# EasyEDA Pro project ProProject_STM32F407IGT6_2024-02-27.epro, schematic Schematic2
Create Date: 2023-12-02; Page Name: P1; Project Name: STM32F407IGT6; Schematic Name: Schematic2; Update Date: 2024-01-13; Company: 嘉立创EDA; Page Size: A3; Version: V1.0
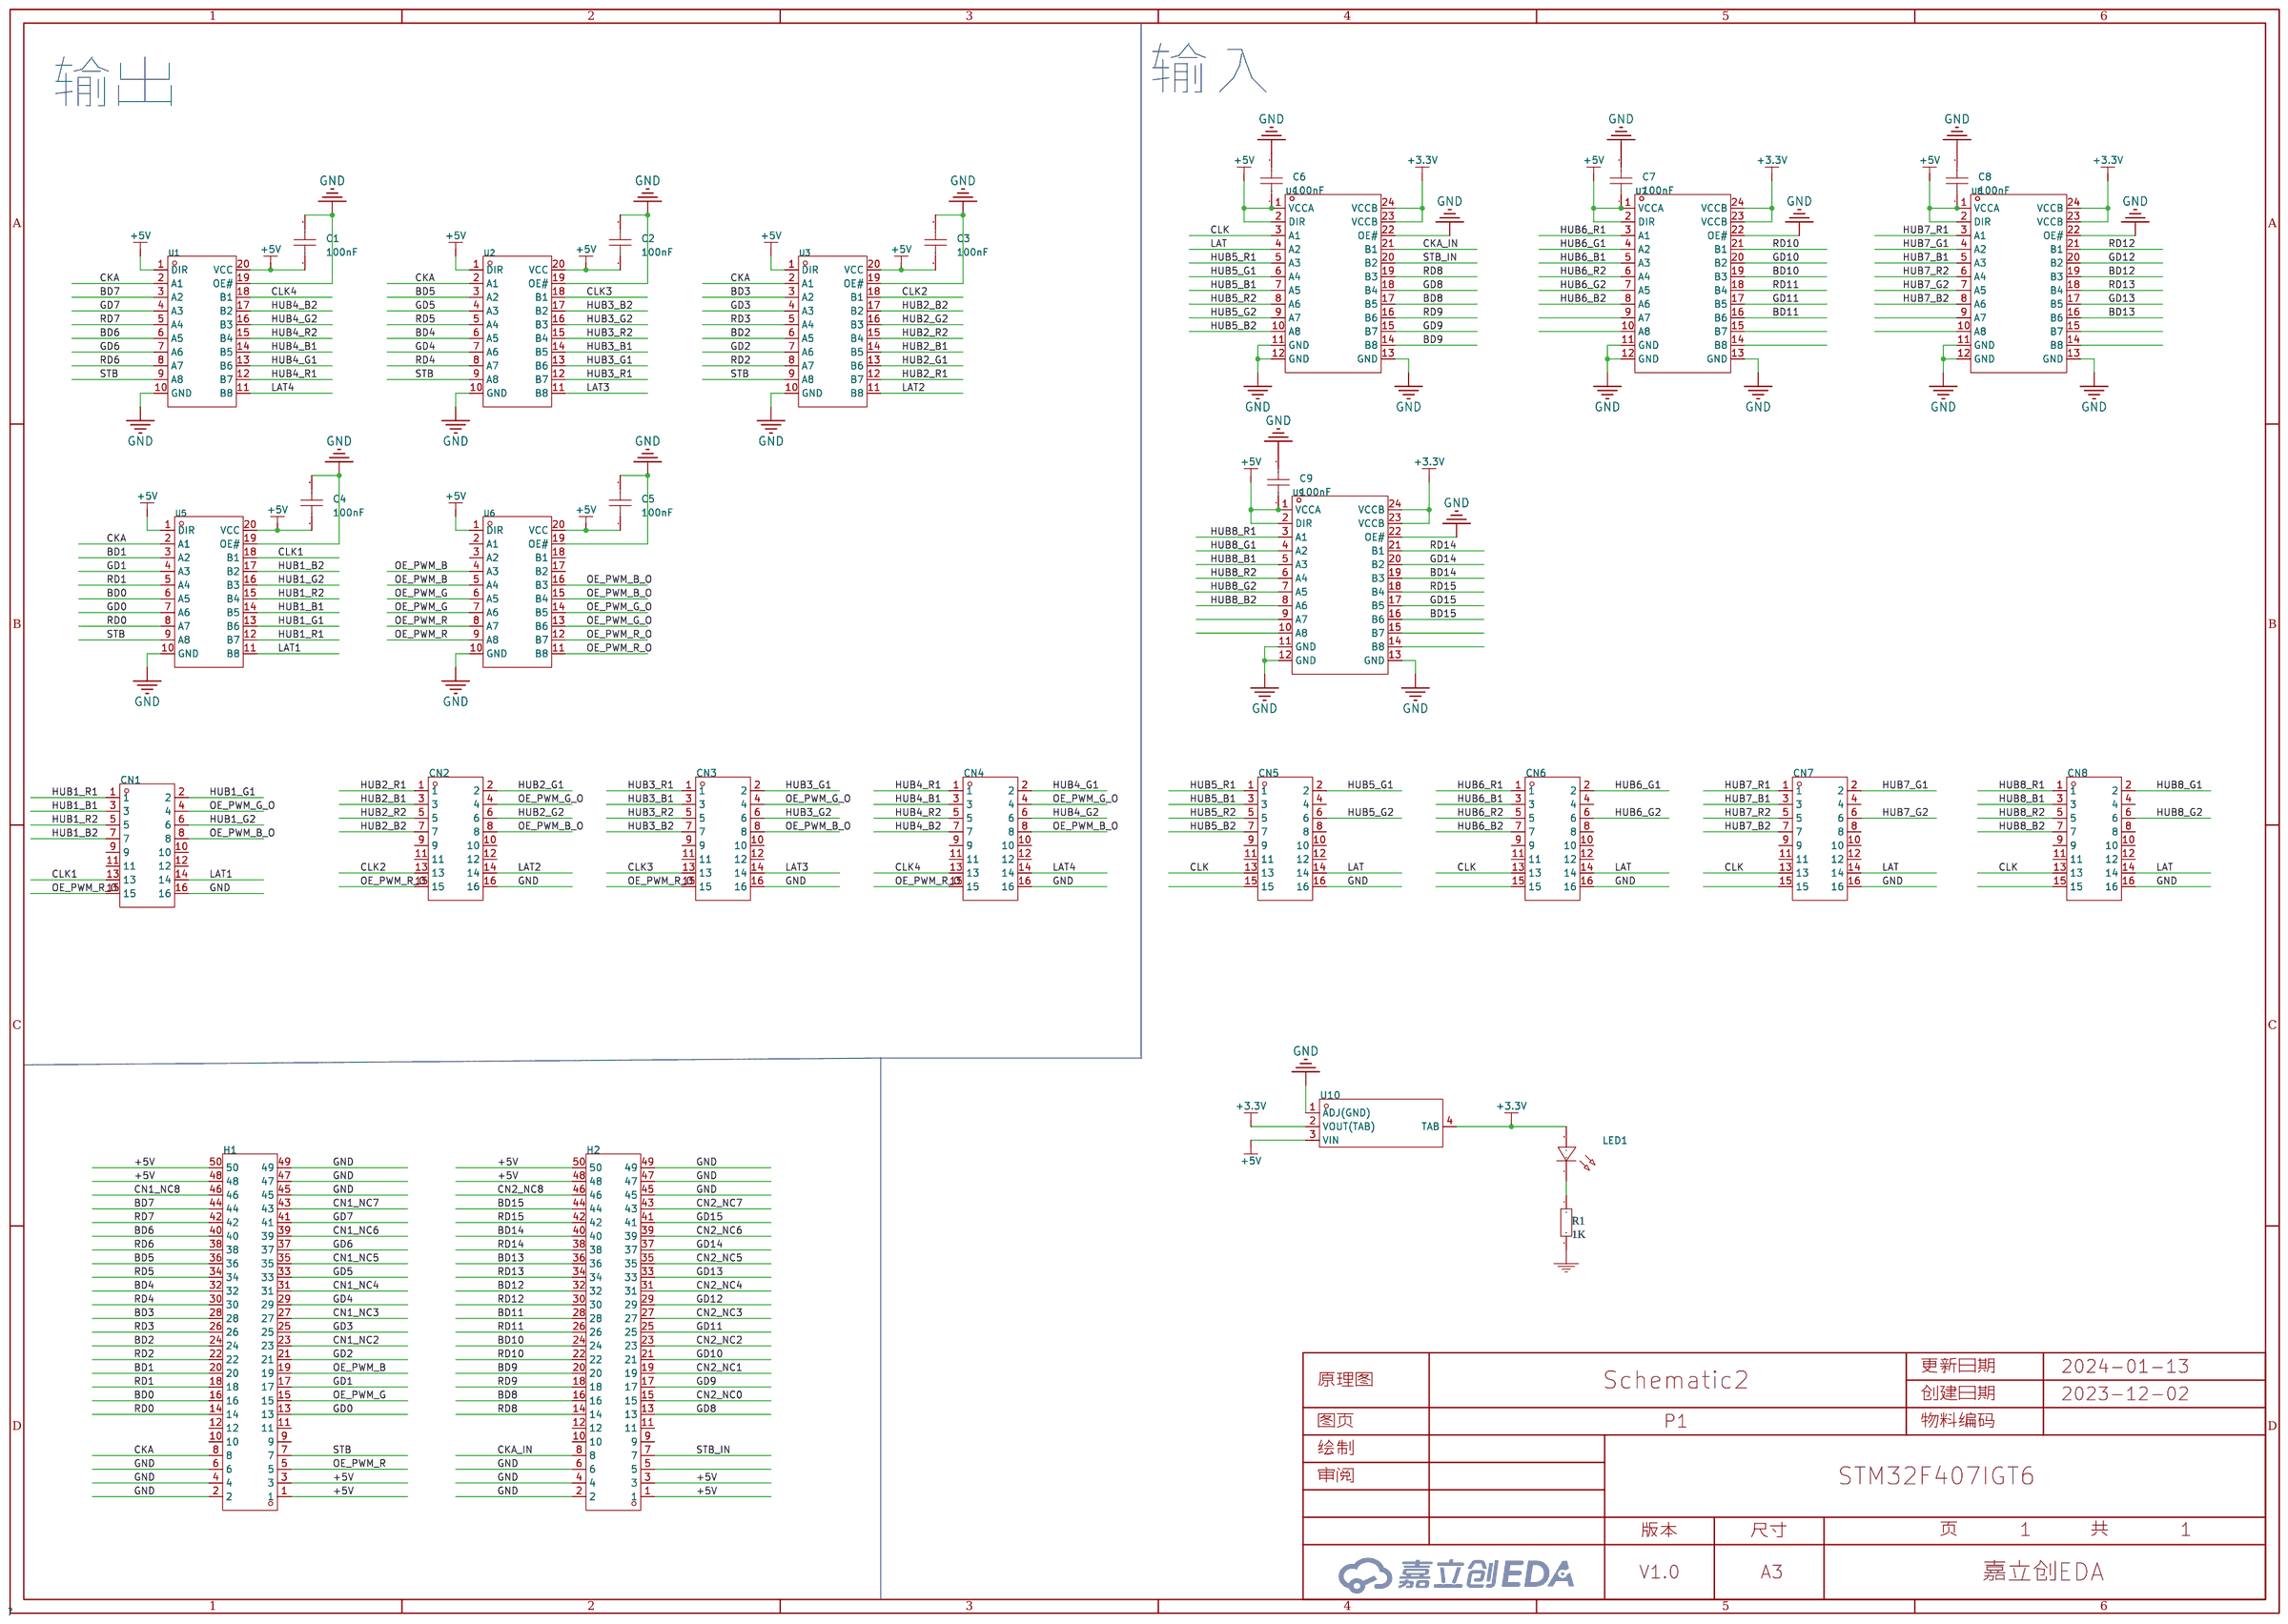
[diagram p2: schematic sheet]

## Parts
C1  100nF  [C0805]
C2  100nF  [C0805]
C3  100nF  [C0805]
C4  100nF  [C0805]
C5  100nF  [C0805]
C6  100nF  [C0805]
C7  100nF  [C0805]
C8  100nF  [C0805]
C9  100nF  [C0805]
CN1  BH254V-16P  [IDC-TH_16P-P2.54-V-R2-C8-S2.54]
CN2  BH254V-16P  [IDC-TH_16P-P2.54-V-R2-C8-S2.54]
CN3  BH254V-16P  [IDC-TH_16P-P2.54-V-R2-C8-S2.54]
CN4  BH254V-16P  [IDC-TH_16P-P2.54-V-R2-C8-S2.54]
CN5  BH254V-16P  [IDC-TH_16P-P2.54-V-R2-C8-S2.54]
CN6  BH254V-16P  [IDC-TH_16P-P2.54-V-R2-C8-S2.54]
CN7  BH254V-16P  [IDC-TH_16P-P2.54-V-R2-C8-S2.54]
CN8  BH254V-16P  [IDC-TH_16P-P2.54-V-R2-C8-S2.54]
H1  FH-00077  [HDR-TH_50P-P2.54-V-F-R2-C25-S2.54-1]
H2  FH-00077  [HDR-TH_50P-P2.54-V-F-R2-C25-S2.54-1]
LED1  -  [LED0805-RD_RED]
R1  1K  [R0805]
U1  SN74HC245PW  [TSSOP-20_L6.5-W4.4-P0.65-LS6.4-BL]
U2  SN74HC245PW  [TSSOP-20_L6.5-W4.4-P0.65-LS6.4-BL]
U3  SN74HC245PW  [TSSOP-20_L6.5-W4.4-P0.65-LS6.4-BL]
U4  SN74LVC4245ADBR  [SSOP-24_L8.4-W5.8-P0.65-LS7.8-BL]
U5  SN74HC245PW  [TSSOP-20_L6.5-W4.4-P0.65-LS6.4-BL]
U6  SN74HC245PW  [TSSOP-20_L6.5-W4.4-P0.65-LS6.4-BL]
U7  SN74LVC4245ADBR  [SSOP-24_L8.4-W5.8-P0.65-LS7.8-BL]
U8  SN74LVC4245ADBR  [SSOP-24_L8.4-W5.8-P0.65-LS7.8-BL]
U9  SN74LVC4245ADBR  [SSOP-24_L8.4-W5.8-P0.65-LS7.8-BL]
U10  AMS1117-3.3  [SOT-223-4_L6.5-W3.5-P2.30-LS7.0-BR]

## Library data of the parts
C1-C9 = CAP_0805: Supplier Footprint: 0805
CN1-CN8 = BH254V-16P: 连接器类型:简牛座;每排PIN数:8;结构:2x8P;排数:2;间距:2.54mm;行距:2.54mm;封装形式:直插;额定电流:3A;额定电压:250V;工作温度范围:-40℃~+105℃;; LCSC Part Name: 每排P数:8 2x8P 排数:2 2.54mm; Supplier Part: C492443; Manufacturer: XFCN(兴飞); Supplier Footprint: 插件,P=2.54mm; JLCPCB Part Class: Extended Part; Datasheet: https://atta.szlcsc.com/upload/public/pdf/source/20200312/C492443_3E905B5DA9DBEF415FB3A1735835F3EF.pdf; Supplier: LCSC; Connector Type: 简牛座; Pin Number in each Row: 8; Structure: 2x8P; Number of Rows: 2; Pitch: 2.54mm; Row Spacing: 2.54mm; Holder Type: 直插; Current Rating (Max): 3A; Voltage Rating (Max): 250V; Operating Temperature Range: -40℃~+105℃
H1 H2 = FH-00077: 排数:双排;总孔位数:50P;间距:2.54mm;插孔结构:2x25P;行距:2.54mm;安装类型:直插;圆孔/方孔:方孔;额定电流:3A;额定电压:-;插孔方向:顶部;塑高:8.5mm;触头材质:黄铜;触头镀层:金;工作温度范围:-40℃~+105℃;焊接温度(最大值):200℃@10S;; LCSC Part Name: 间距:2.54mm 2x25P 直插; Supplier Part: C2829906; Manufacturer: Liansheng(连盛); Supplier Footprint: 插件,P=2.54mm; JLCPCB Part Class: Extended Part; Datasheet: https://atta.szlcsc.com/upload/public/pdf/source/20210507/C2829906_25210A678061599288A41211DEFA1349.pdf; Supplier: LCSC; Number of Rows: 双排; Number of Holes: 50P; Pitch: 2.54mm; Holes Structure: 2x25P; Row Spacing: 2.54mm; Mounting Type: 直插; Circular Hole / Square Hole: 方孔; Current Rating (Max): 3A; Holes Direction: 顶部; Insulation Height: 8.5mm; Contact Material: 黄铜; Contact Plating: 金; Operating Temperature Range: -40℃~+105℃; Welding Temperature (Max): 200℃@10S
LED1 = LED_0805-G: Supplier Footprint: 0805
R1 = 1K: Published: 8-Jun-2000; LatestRevisionDate: 17-Jul-2002; LatestRevisionNote: Re-released for DXP Platform.; PackageReference: AXIAL-0.4; Publisher: Altium Limited
U1-U3 U5 U6 = SN74HC245PW: 具有三态输出的八路总线收发器 20-TSSOP -40 to 85; Supplier Part: C2871191; Manufacturer: TI(德州仪器); Supplier Footprint: TSSOP-20; JLCPCB Part Class: 扩展库; Datasheet: https://www.ti.com/cn/lit/gpn/sn74hc245; Supplier: LCSC
U4 U7-U9 = SN74LVC4245ADBR: SN74LVC4245A 具有三态输出的八路总线收发器和 3.3V 至 5V 移位器; Supplier Part: C7857; Manufacturer: TI(德州仪器); Supplier Footprint: SSOP-24-208mil; JLCPCB Part Class: 扩展库; Datasheet: https://www.ti.com/cn/lit/gpn/sn74lvc4245a; Supplier: LCSC
U10 = AMS1117-3.3_C347222: 输出类型:固定;最大输入电压:18V;输出电压:3.3V;输出电流:1A;电源纹波抑制比(PSRR):60dB@(120Hz);输出极性:正;; LCSC Part Name: 输入18V 输出3.3V 1A; Supplier Part: C347222; Manufacturer: UMW(友台半导体); Supplier Footprint: SOT-223; JLCPCB Part Class: 扩展库; Datasheet: https://atta.szlcsc.com/upload/public/pdf/source/20231109/155D79A26D9DB04352555A58D5969DC8.pdf; Supplier: LCSC; Output Type: 固定; Maximum Input Voltage: 18V; Output Voltage: 3.3V; Output Current: 1A; Power Supply Rejection Ratio (PSRR): 60dB@(120Hz); Dropout Voltage: 1.3V@(1A); Output Polarity: 正; Number of Outputs: 1

## Nets
+3.3V: LED1.2(A) U4.23(VCCB) U4.24(VCCB) U7.23(VCCB) U7.24(VCCB) U8.23(VCCB) U8.24(VCCB) U9.23(VCCB) U9.24(VCCB) U10.2(VOUT(TAB)) U10.4(TAB)
+5V: C1.1 C2.1 C3.1 C4.1 C5.1 C6.1 C7.1 C8.1 C9.1 H1.1 H1.3 H1.48 H1.50 H2.1 H2.3 H2.48 H2.50 U1.1(DIR) U1.20(VCC) U2.1(DIR) U2.20(VCC) U3.1(DIR) U3.20(VCC) U4.1(VCCA) U4.2(DIR) U5.1(DIR) U5.20(VCC) U6.1(DIR) U6.20(VCC) U7.1(VCCA) U7.2(DIR) U8.1(VCCA) U8.2(DIR) U9.1(VCCA) U9.2(DIR) U10.3(VIN)
GND: C1.2 C2.2 C3.2 C4.2 C5.2 C6.2 C7.2 C8.2 C9.2 CN1.16 CN2.16 CN3.16 CN4.16 CN5.16 CN6.16 CN7.16 CN8.16 H1.2 H1.4 H1.6 H1.45 H1.47 H1.49 H2.2 H2.4 H2.6 H2.45 H2.47 H2.49 R1.2 U1.10(GND) U1.19(OE#) U2.10(GND) U2.19(OE#) U3.10(GND) U3.19(OE#) U4.11(GND) U4.12(GND) U4.13(GND) U4.22(OE#) U5.10(GND) U5.19(OE#) U6.10(GND) U6.19(OE#) U7.11(GND) U7.12(GND) U7.13(GND) U7.22(OE#) U8.11(GND) U8.12(GND) U8.13(GND) U8.22(OE#) U9.11(GND) U9.12(GND) U9.13(GND) U9.22(OE#) U10.1(ADJ(GND))
BD0: H1.16 U5.6(A5)
BD1: H1.20 U5.3(A2)
BD2: H1.24 U3.6(A5)
BD3: H1.28 U3.3(A2)
BD4: H1.32 U2.6(A5)
BD5: H1.36 U2.3(A2)
BD6: H1.40 U1.6(A5)
BD7: H1.44 U1.3(A2)
BD8: H2.16 U4.17(B5)
BD9: H2.20 U4.14(B8)
BD10: H2.24 U7.19(B3)
BD11: H2.28 U7.16(B6)
BD12: H2.32 U8.19(B3)
BD13: H2.36 U8.16(B6)
BD14: H2.40 U9.19(B3)
BD15: H2.44 U9.16(B6)
CKA: H1.8 U1.2(A1) U2.2(A1) U3.2(A1) U5.2(A1)
CKA_IN: H2.8 U4.21(B1)
CLK: CN5.13 CN6.13 CN7.13 CN8.13 U4.3(A1)
CLK1: CN1.13 U5.18(B1)
CLK2: CN2.13 U3.18(B1)
CLK3: CN3.13 U2.18(B1)
CLK4: CN4.13 U1.18(B1)
CN1_NC2: H1.23
CN1_NC3: H1.27
CN1_NC4: H1.31
CN1_NC5: H1.35
CN1_NC6: H1.39
CN1_NC7: H1.43
CN1_NC8: H1.46
CN2_NC0: H2.15
CN2_NC1: H2.19
CN2_NC2: H2.23
CN2_NC3: H2.27
CN2_NC4: H2.31
CN2_NC5: H2.35
CN2_NC6: H2.39
CN2_NC7: H2.43
CN2_NC8: H2.46
GD0: H1.13 U5.7(A6)
GD1: H1.17 U5.4(A3)
GD2: H1.21 U3.7(A6)
GD3: H1.25 U3.4(A3)
GD4: H1.29 U2.7(A6)
GD5: H1.33 U2.4(A3)
GD6: H1.37 U1.7(A6)
GD7: H1.41 U1.4(A3)
GD8: H2.13 U4.18(B4)
GD9: H2.17 U4.15(B7)
GD10: H2.21 U7.20(B2)
GD11: H2.25 U7.17(B5)
GD12: H2.29 U8.20(B2)
GD13: H2.33 U8.17(B5)
GD14: H2.37 U9.20(B2)
GD15: H2.41 U9.17(B5)
HUB1_B1: CN1.3 U5.14(B5)
HUB1_B2: CN1.7 U5.17(B2)
HUB1_G1: CN1.2 U5.13(B6)
HUB1_G2: CN1.6 U5.16(B3)
HUB1_R1: CN1.1 U5.12(B7)
HUB1_R2: CN1.5 U5.15(B4)
HUB2_B1: CN2.3 U3.14(B5)
HUB2_B2: CN2.7 U3.17(B2)
HUB2_G1: CN2.2 U3.13(B6)
HUB2_G2: CN2.6 U3.16(B3)
HUB2_R1: CN2.1 U3.12(B7)
HUB2_R2: CN2.5 U3.15(B4)
HUB3_B1: CN3.3 U2.14(B5)
HUB3_B2: CN3.7 U2.17(B2)
HUB3_G1: CN3.2 U2.13(B6)
HUB3_G2: CN3.6 U2.16(B3)
HUB3_R1: CN3.1 U2.12(B7)
HUB3_R2: CN3.5 U2.15(B4)
HUB4_B1: CN4.3 U1.14(B5)
HUB4_B2: CN4.7 U1.17(B2)
HUB4_G1: CN4.2 U1.13(B6)
HUB4_G2: CN4.6 U1.16(B3)
HUB4_R1: CN4.1 U1.12(B7)
HUB4_R2: CN4.5 U1.15(B4)
HUB5_B1: CN5.3 U4.7(A5)
HUB5_B2: CN5.7 U4.10(A8)
HUB5_G1: CN5.2 U4.6(A4)
HUB5_G2: CN5.6 U4.9(A7)
HUB5_R1: CN5.1 U4.5(A3)
HUB5_R2: CN5.5 U4.8(A6)
HUB6_B1: CN6.3 U7.5(A3)
HUB6_B2: CN6.7 U7.8(A6)
HUB6_G1: CN6.2 U7.4(A2)
HUB6_G2: CN6.6 U7.7(A5)
HUB6_R1: CN6.1 U7.3(A1)
HUB6_R2: CN6.5 U7.6(A4)
HUB7_B1: CN7.3 U8.5(A3)
HUB7_B2: CN7.7 U8.8(A6)
HUB7_G1: CN7.2 U8.4(A2)
HUB7_G2: CN7.6 U8.7(A5)
HUB7_R1: CN7.1 U8.3(A1)
HUB7_R2: CN7.5 U8.6(A4)
HUB8_B1: CN8.3 U9.5(A3)
HUB8_B2: CN8.7 U9.8(A6)
HUB8_G1: CN8.2 U9.4(A2)
HUB8_G2: CN8.6 U9.7(A5)
HUB8_R1: CN8.1 U9.3(A1)
HUB8_R2: CN8.5 U9.6(A4)
LAT: CN5.14 CN6.14 CN7.14 CN8.14 U4.4(A2)
LAT1: CN1.14 U5.11(B8)
LAT2: CN2.14 U3.11(B8)
LAT3: CN3.14 U2.11(B8)
LAT4: CN4.14 U1.11(B8)
OE_PWM_B: H1.19 U6.4(A3) U6.5(A4)
OE_PWM_B_O: CN1.8 CN2.8 CN3.8 CN4.8 U6.15(B4) U6.16(B3)
OE_PWM_G: H1.15 U6.6(A5) U6.7(A6)
OE_PWM_G_O: CN1.4 CN2.4 CN3.4 CN4.4 U6.13(B6) U6.14(B5)
OE_PWM_R: H1.5 U6.8(A7) U6.9(A8)
OE_PWM_R_O: CN1.15 CN2.15 CN3.15 CN4.15 U6.11(B8) U6.12(B7)
RD0: H1.14 U5.8(A7)
RD1: H1.18 U5.5(A4)
RD2: H1.22 U3.8(A7)
RD3: H1.26 U3.5(A4)
RD4: H1.30 U2.8(A7)
RD5: H1.34 U2.5(A4)
RD6: H1.38 U1.8(A7)
RD7: H1.42 U1.5(A4)
RD8: H2.14 U4.19(B3)
RD9: H2.18 U4.16(B6)
RD10: H2.22 U7.21(B1)
RD11: H2.26 U7.18(B4)
RD12: H2.30 U8.21(B1)
RD13: H2.34 U8.18(B4)
RD14: H2.38 U9.21(B1)
RD15: H2.42 U9.18(B4)
STB: H1.7 U1.9(A8) U2.9(A8) U3.9(A8) U5.9(A8)
STB_IN: H2.7 U4.20(B2)
$1N9953: LED1.1(C) R1.1

Not connected (* = marked no-connect by the designer): CN1 9 10 11 12; CN2 9 10 11 12; CN3 9 10 11 12; CN4 9 10 11 12; CN5 4 8 9 10 11 12 15; CN6 4 8 9 10 11 12 15; CN7 4 8 9 10 11 12 15; CN8 4 8 9 10 11 12 15; H1 9 10 11 12; H2 5 9 10 11 12; U6 2(A1) 3(A2) 17(B2) 18(B1); U7 9(A7) 10(A8) 14(B8) 15(B7); U8 9(A7) 10(A8) 14(B8) 15(B7); U9 9(A7) 10(A8) 14(B8) 15(B7)

## Notes on the sheet
- 输出
- 输入
